# Altium project roach2_project rev2.PrjPCB (part 9 of 13)

## Sheet ppc_power.SchDoc: PowerPC Power Input
size A3; Date: DO NOT USE, RATHER USE PROJ OPTIONS; DrawnBy: DO NOT USE, RATHER USE PROJ OPTIONS; Engineer: DO NOT USE, RATHER USE PROJ OPTIONS; Organization: DO NOT USE, RATHER USE PROJ OPTIONS; DocumentNumber: DO NOT USE, RATHER USE PROJ OPTIONS; Revision: DO NOT USE, RATHER USE PROJ OPTIONS; SheetNumber: 4; SheetTotal: 27; SCH_Sheet_Filename: ppc_power.SchDoc; CurrentTime: DO NOT USE, RATHER USE PROJ OPTIONS; Time: DO NOT USE, RATHER USE PROJ OPTIONS; DocumentFullPathAndName: DO NOT USE, RATHER USE PROJ OPTIONS; DocumentName: DO NOT USE, RATHER USE PROJ OPTIONS; ModifiedDate: DO NOT USE, RATHER USE PROJ OPTIONS; ImagePath: DO NOT USE, RATHER USE PROJ OPTIONS
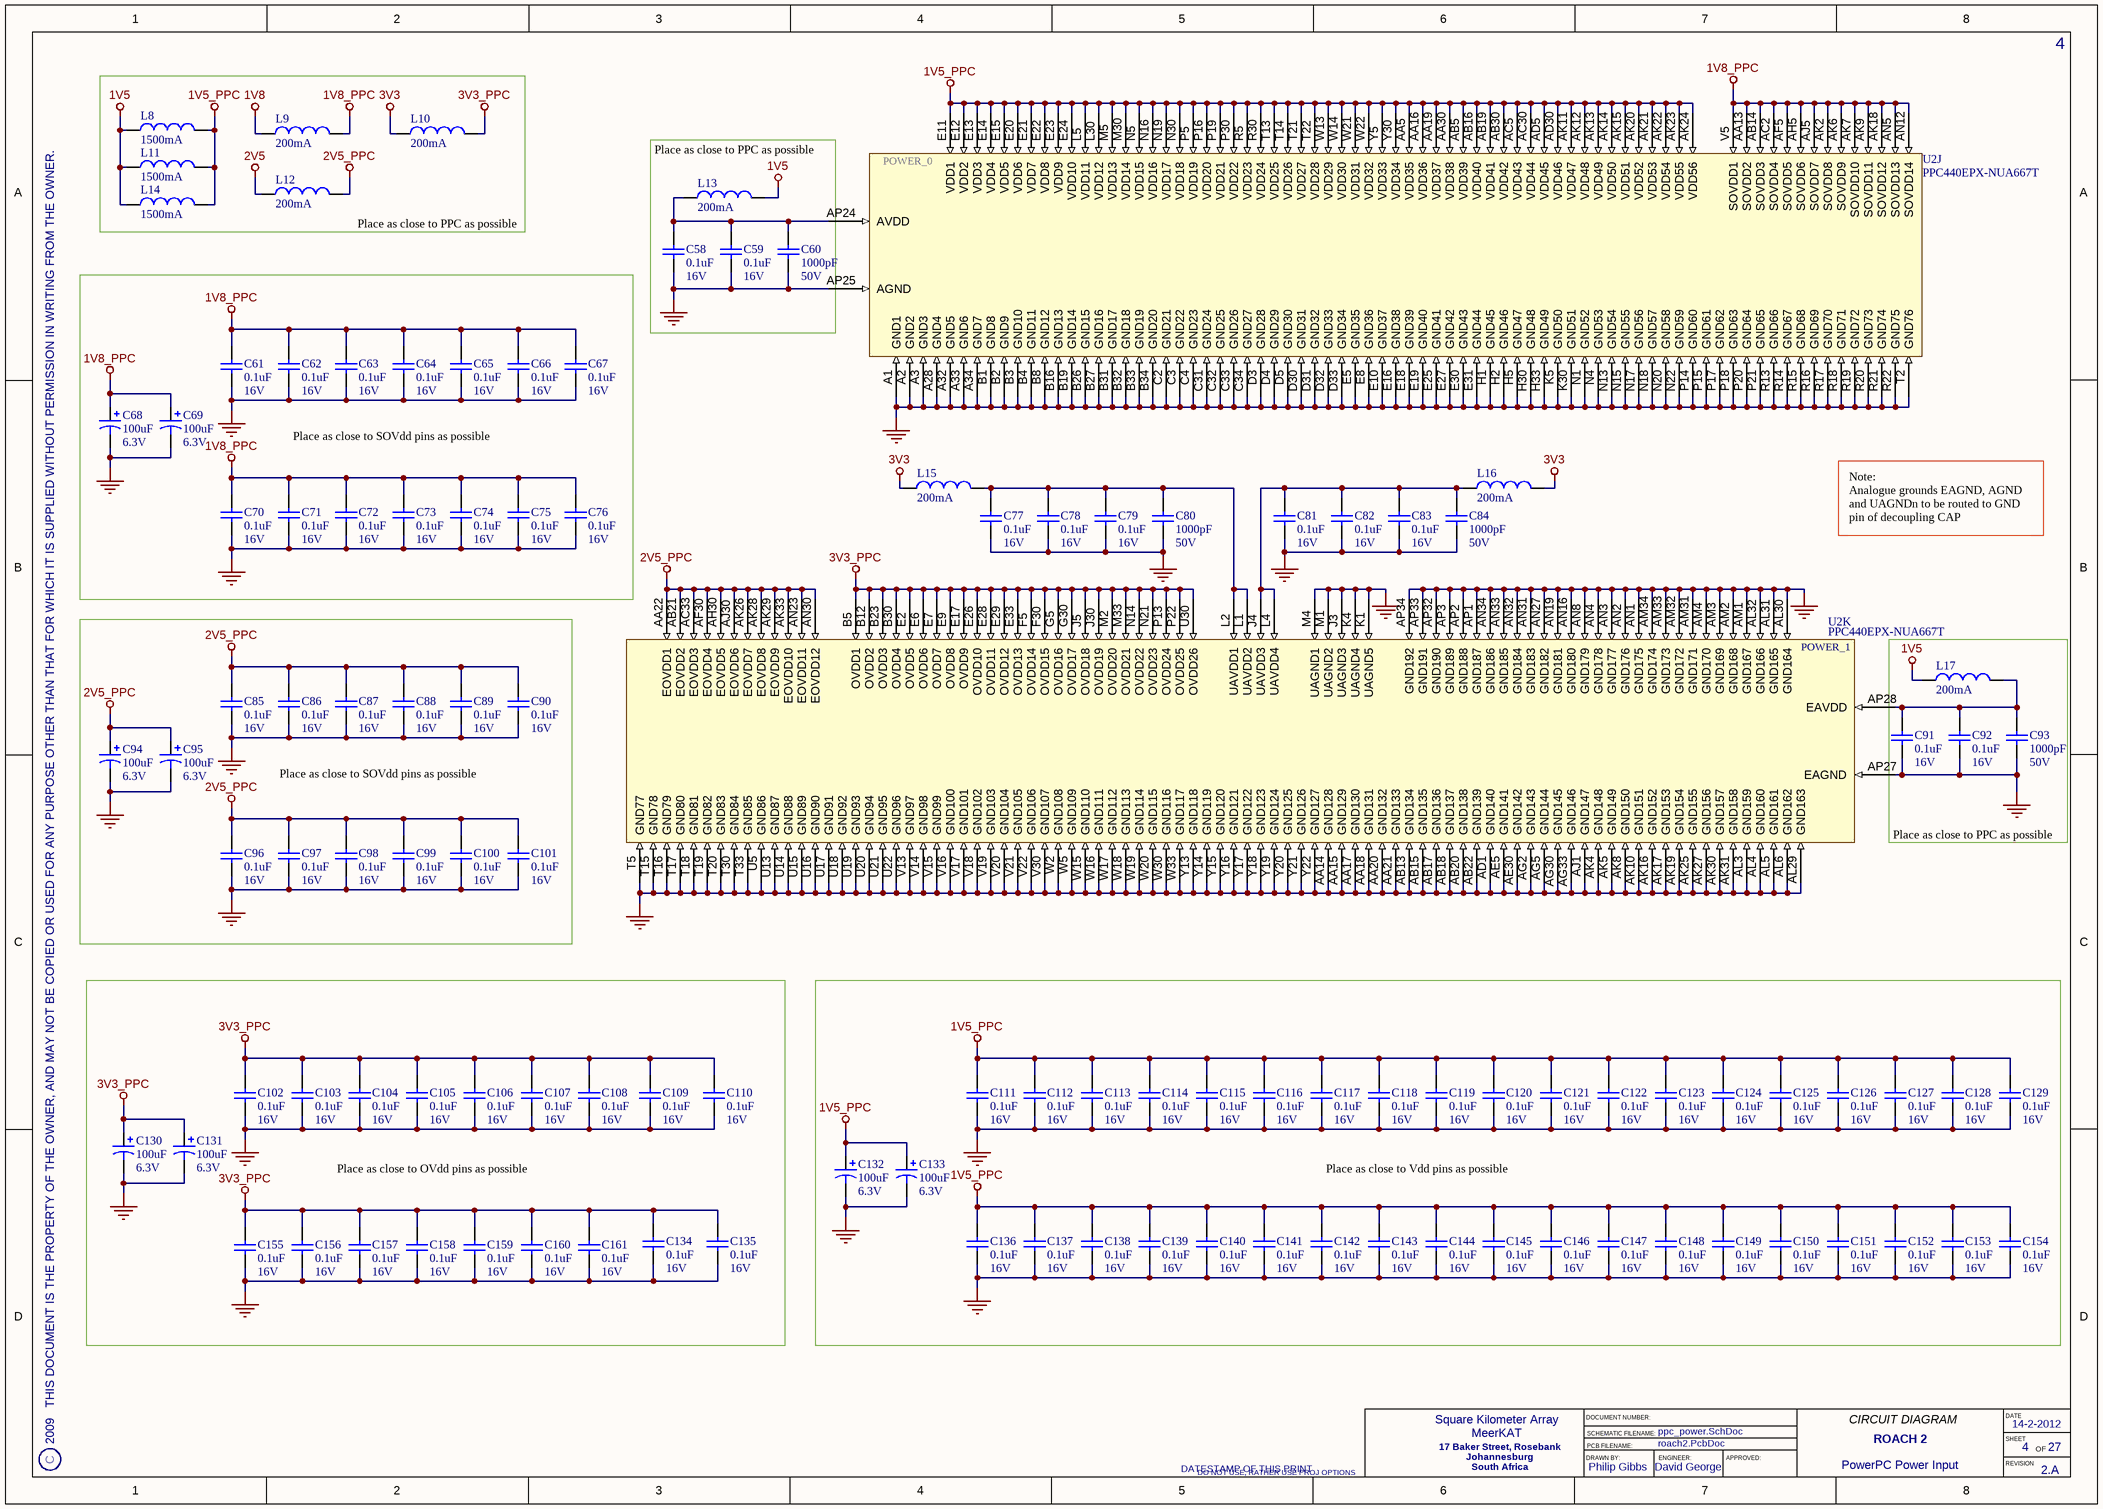
[diagram p19: ppc_power.SchDoc]

### Parts
C58  Rating: 16V  [CAPC1005X60L]  (hidden comment: 0.1uF)
C59  Rating: 16V  [CAPC1005X60L]  (hidden comment: 0.1uF)
C60  Rating: 50V  [CAPC1005X55L]  (hidden comment: 1000pF)
C61  Rating: 16V  [CAPC1005X60L]  (hidden comment: 0.1uF)
C62  Rating: 16V  [CAPC1005X60L]  (hidden comment: 0.1uF)
C63  Rating: 16V  [CAPC1005X60L]  (hidden comment: 0.1uF)
C64  Rating: 16V  [CAPC1005X60L]  (hidden comment: 0.1uF)
C65  Rating: 16V  [CAPC1005X60L]  (hidden comment: 0.1uF)
C66  Rating: 16V  [CAPC1005X60L]  (hidden comment: 0.1uF)
C67  Rating: 16V  [CAPC1005X60L]  (hidden comment: 0.1uF)
C68  Rating: 6.3V  [CAPMP3528X210L]  (hidden comment: 100uF)
C69  Rating: 6.3V  [CAPMP3528X210L]  (hidden comment: 100uF)
C70  Rating: 16V  [CAPC1005X60L]  (hidden comment: 0.1uF)
C71  Rating: 16V  [CAPC1005X60L]  (hidden comment: 0.1uF)
C72  Rating: 16V  [CAPC1005X60L]  (hidden comment: 0.1uF)
C73  Rating: 16V  [CAPC1005X60L]  (hidden comment: 0.1uF)
C74  Rating: 16V  [CAPC1005X60L]  (hidden comment: 0.1uF)
C75  Rating: 16V  [CAPC1005X60L]  (hidden comment: 0.1uF)
C76  Rating: 16V  [CAPC1005X60L]  (hidden comment: 0.1uF)
C77  Rating: 16V  [CAPC1005X60L]  (hidden comment: 0.1uF)
C78  Rating: 16V  [CAPC1005X60L]  (hidden comment: 0.1uF)
C79  Rating: 16V  [CAPC1005X60L]  (hidden comment: 0.1uF)
C80  Rating: 50V  [CAPC1005X55L]  (hidden comment: 1000pF)
C81  Rating: 16V  [CAPC1005X60L]  (hidden comment: 0.1uF)
C82  Rating: 16V  [CAPC1005X60L]  (hidden comment: 0.1uF)
C83  Rating: 16V  [CAPC1005X60L]  (hidden comment: 0.1uF)
C84  Rating: 50V  [CAPC1005X55L]  (hidden comment: 1000pF)
C85  Rating: 16V  [CAPC1005X60L]  (hidden comment: 0.1uF)
C86  Rating: 16V  [CAPC1005X60L]  (hidden comment: 0.1uF)
C87  Rating: 16V  [CAPC1005X60L]  (hidden comment: 0.1uF)
C88  Rating: 16V  [CAPC1005X60L]  (hidden comment: 0.1uF)
C89  Rating: 16V  [CAPC1005X60L]  (hidden comment: 0.1uF)
C90  Rating: 16V  [CAPC1005X60L]  (hidden comment: 0.1uF)
C91  Rating: 16V  [CAPC1005X60L]  (hidden comment: 0.1uF)
C92  Rating: 16V  [CAPC1005X60L]  (hidden comment: 0.1uF)
C93  Rating: 50V  [CAPC1005X55L]  (hidden comment: 1000pF)
C94  Rating: 6.3V  [CAPMP3528X210L]  (hidden comment: 100uF)
C95  Rating: 6.3V  [CAPMP3528X210L]  (hidden comment: 100uF)
C96  Rating: 16V  [CAPC1005X60L]  (hidden comment: 0.1uF)
C97  Rating: 16V  [CAPC1005X60L]  (hidden comment: 0.1uF)
C98  Rating: 16V  [CAPC1005X60L]  (hidden comment: 0.1uF)
C99  Rating: 16V  [CAPC1005X60L]  (hidden comment: 0.1uF)
C100  Rating: 16V  [CAPC1005X60L]  (hidden comment: 0.1uF)
C101  Rating: 16V  [CAPC1005X60L]  (hidden comment: 0.1uF)
C102  Rating: 16V  [CAPC1005X60L]  (hidden comment: 0.1uF)
C103  Rating: 16V  [CAPC1005X60L]  (hidden comment: 0.1uF)
C104  Rating: 16V  [CAPC1005X60L]  (hidden comment: 0.1uF)
C105  Rating: 16V  [CAPC1005X60L]  (hidden comment: 0.1uF)
C106  Rating: 16V  [CAPC1005X60L]  (hidden comment: 0.1uF)
C107  Rating: 16V  [CAPC1005X60L]  (hidden comment: 0.1uF)
C108  Rating: 16V  [CAPC1005X60L]  (hidden comment: 0.1uF)
C109  Rating: 16V  [CAPC1005X60L]  (hidden comment: 0.1uF)
C110  Rating: 16V  [CAPC1005X60L]  (hidden comment: 0.1uF)
C111  Rating: 16V  [CAPC1005X60L]  (hidden comment: 0.1uF)
C112  Rating: 16V  [CAPC1005X60L]  (hidden comment: 0.1uF)
C113  Rating: 16V  [CAPC1005X60L]  (hidden comment: 0.1uF)
C114  Rating: 16V  [CAPC1005X60L]  (hidden comment: 0.1uF)
C115  Rating: 16V  [CAPC1005X60L]  (hidden comment: 0.1uF)
C116  Rating: 16V  [CAPC1005X60L]  (hidden comment: 0.1uF)
C117  Rating: 16V  [CAPC1005X60L]  (hidden comment: 0.1uF)
C118  Rating: 16V  [CAPC1005X60L]  (hidden comment: 0.1uF)
C119  Rating: 16V  [CAPC1005X60L]  (hidden comment: 0.1uF)
C120  Rating: 16V  [CAPC1005X60L]  (hidden comment: 0.1uF)
C121  Rating: 16V  [CAPC1005X60L]  (hidden comment: 0.1uF)
C122  Rating: 16V  [CAPC1005X60L]  (hidden comment: 0.1uF)
C123  Rating: 16V  [CAPC1005X60L]  (hidden comment: 0.1uF)
C124  Rating: 16V  [CAPC1005X60L]  (hidden comment: 0.1uF)
C125  Rating: 16V  [CAPC1005X60L]  (hidden comment: 0.1uF)
C126  Rating: 16V  [CAPC1005X60L]  (hidden comment: 0.1uF)
C127  Rating: 16V  [CAPC1005X60L]  (hidden comment: 0.1uF)
C128  Rating: 16V  [CAPC1005X60L]  (hidden comment: 0.1uF)
C129  Rating: 16V  [CAPC1005X60L]  (hidden comment: 0.1uF)
C130  Rating: 6.3V  [CAPMP3528X210L]  (hidden comment: 100uF)
C131  Rating: 6.3V  [CAPMP3528X210L]  (hidden comment: 100uF)
C132  Rating: 6.3V  [CAPMP3528X210L]  (hidden comment: 100uF)
C133  Rating: 6.3V  [CAPMP3528X210L]  (hidden comment: 100uF)
C134  Rating: 16V  [CAPC1005X60L]  (hidden comment: 0.1uF)
C135  Rating: 16V  [CAPC1005X60L]  (hidden comment: 0.1uF)
C136  Rating: 16V  [CAPC1005X60L]  (hidden comment: 0.1uF)
C137  Rating: 16V  [CAPC1005X60L]  (hidden comment: 0.1uF)
C138  Rating: 16V  [CAPC1005X60L]  (hidden comment: 0.1uF)
C139  Rating: 16V  [CAPC1005X60L]  (hidden comment: 0.1uF)
C140  Rating: 16V  [CAPC1005X60L]  (hidden comment: 0.1uF)
C141  Rating: 16V  [CAPC1005X60L]  (hidden comment: 0.1uF)
C142  Rating: 16V  [CAPC1005X60L]  (hidden comment: 0.1uF)
C143  Rating: 16V  [CAPC1005X60L]  (hidden comment: 0.1uF)
C144  Rating: 16V  [CAPC1005X60L]  (hidden comment: 0.1uF)
C145  Rating: 16V  [CAPC1005X60L]  (hidden comment: 0.1uF)
C146  Rating: 16V  [CAPC1005X60L]  (hidden comment: 0.1uF)
C147  Rating: 16V  [CAPC1005X60L]  (hidden comment: 0.1uF)
C148  Rating: 16V  [CAPC1005X60L]  (hidden comment: 0.1uF)
C149  Rating: 16V  [CAPC1005X60L]  (hidden comment: 0.1uF)
C150  Rating: 16V  [CAPC1005X60L]  (hidden comment: 0.1uF)
C151  Rating: 16V  [CAPC1005X60L]  (hidden comment: 0.1uF)
C152  Rating: 16V  [CAPC1005X60L]  (hidden comment: 0.1uF)
C153  Rating: 16V  [CAPC1005X60L]  (hidden comment: 0.1uF)
C154  Rating: 16V  [CAPC1005X60L]  (hidden comment: 0.1uF)
C155  Rating: 16V  [CAPC1005X60L]  (hidden comment: 0.1uF)
C156  Rating: 16V  [CAPC1005X60L]  (hidden comment: 0.1uF)
C157  Rating: 16V  [CAPC1005X60L]  (hidden comment: 0.1uF)
C158  Rating: 16V  [CAPC1005X60L]  (hidden comment: 0.1uF)
C159  Rating: 16V  [CAPC1005X60L]  (hidden comment: 0.1uF)
C160  Rating: 16V  [CAPC1005X60L]  (hidden comment: 0.1uF)
C161  Rating: 16V  [CAPC1005X60L]  (hidden comment: 0.1uF)
L8  Rating: 1500mA  [INDC1608X130L]  (hidden comment: 180R)
L9  Rating: 200mA  [INDC2012X130L]  (hidden comment: 600R)
L10  Rating: 200mA  [INDC2012X130L]  (hidden comment: 600R)
L11  Rating: 1500mA  [INDC1608X130L]  (hidden comment: 180R)
L12  Rating: 200mA  [INDC2012X130L]  (hidden comment: 600R)
L13  Rating: 200mA  [INDC2012X130L]  (hidden comment: 600R)
L14  Rating: 1500mA  [INDC1608X130L]  (hidden comment: 180R)
L15  Rating: 200mA  [INDC2012X130L]  (hidden comment: 600R)
L16  Rating: 200mA  [INDC2012X130L]  (hidden comment: 600R)
L17  Rating: 200mA  [INDC2012X130L]  (hidden comment: 600R)
U2  PPC440EPX-NUA667T  [TE-PBGA680]  (parts J,K of 11)

### Nets
1V5: L8.1 L11.1 L13.2 L14.1 L17.1
1V5_PPC: C111.2 C112.2 C113.2 C114.2 C115.2 C116.2 C117.2 C118.2 C119.2 C120.2 C121.2 C122.2 C123.2 C124.2 C125.2 C126.2 C127.2 C128.2 C129.2 C132.1 C133.1 C136.2 C137.2 C138.2 C139.2 C140.2 C141.2 C142.2 C143.2 C144.2 C145.2 C146.2 C147.2 C148.2 C149.2 C150.2 C151.2 C152.2 C153.2 C154.2 L8.2 L11.2 L14.2 U2.AA5(VDD35) U2.AA16(VDD36) U2.AA19(VDD37) U2.AA30(VDD38) U2.AB5(VDD39) U2.AB16(VDD40) U2.AB19(VDD41) U2.AB30(VDD42) U2.AC5(VDD43) U2.AC30(VDD44) U2.AD5(VDD45) U2.AD30(VDD46) U2.AK11(VDD47) U2.AK12(VDD48) U2.AK13(VDD49) U2.AK14(VDD50) U2.AK15(VDD51) U2.AK20(VDD52) U2.AK21(VDD53) U2.AK22(VDD54) U2.AK23(VDD55) U2.AK24(VDD56) U2.E11(VDD1) U2.E12(VDD2) U2.E13(VDD3) U2.E14(VDD4) U2.E15(VDD5) U2.E20(VDD6) U2.E21(VDD7) U2.E22(VDD8) U2.E23(VDD9) U2.E24(VDD10) U2.L5(VDD11) U2.L30(VDD12) U2.M5(VDD13) U2.M30(VDD14) U2.N5(VDD15) U2.N16(VDD16) U2.N19(VDD17) U2.N30(VDD18) U2.P5(VDD19) U2.P16(VDD20) U2.P19(VDD21) U2.P30(VDD22) U2.R5(VDD23) U2.R30(VDD24) U2.T13(VDD25) U2.T14(VDD26) U2.T21(VDD27) U2.T22(VDD28) U2.W13(VDD29) U2.W14(VDD30) U2.W21(VDD31) U2.W22(VDD32) U2.Y5(VDD33) U2.Y30(VDD34)
1V8: L9.1
1V8_PPC: C61.2 C62.2 C63.2 C64.2 C65.2 C66.2 C67.2 C68.1 C69.1 C70.2 C71.2 C72.2 C73.2 C74.2 C75.2 C76.2 L9.2 U2.AA13(SOVDD2) U2.AB14(SOVDD3) U2.AC2(SOVDD4) U2.AF5(SOVDD5) U2.AH5(SOVDD6) U2.AJ5(SOVDD7) U2.AK2(SOVDD8) U2.AK6(SOVDD9) U2.AK7(SOVDD10) U2.AK9(SOVDD11) U2.AK18(SOVDD12) U2.AN5(SOVDD13) U2.AN12(SOVDD14) U2.V5(SOVDD1)
2V5: L12.1
2V5_PPC: C85.2 C86.2 C87.2 C88.2 C89.2 C90.2 C94.1 C95.1 C96.2 C97.2 C98.2 C99.2 C100.2 C101.2 L12.2 U2.AA22(EOVDD1) U2.AB21(EOVDD2) U2.AC33(EOVDD3) U2.AF30(EOVDD4) U2.AH30(EOVDD5) U2.AJ30(EOVDD6) U2.AK26(EOVDD7) U2.AK28(EOVDD8) U2.AK29(EOVDD9) U2.AK33(EOVDD10) U2.AN23(EOVDD11) U2.AN30(EOVDD12)
3V3: L10.1 L15.1 L16.2
3V3_PPC: C102.2 C103.2 C104.2 C105.2 C106.2 C107.2 C108.2 C109.2 C110.2 C130.1 C131.1 C134.2 C135.2 C155.2 C156.2 C157.2 C158.2 C159.2 C160.2 C161.2 L10.2 U2.B5(OVDD1) U2.B12(OVDD2) U2.B23(OVDD3) U2.B30(OVDD4) U2.E2(OVDD5) U2.E6(OVDD6) U2.E7(OVDD7) U2.E9(OVDD8) U2.E17(OVDD9) U2.E26(OVDD10) U2.E28(OVDD11) U2.E29(OVDD12) U2.E33(OVDD13) U2.F5(OVDD14) U2.F30(OVDD15) U2.G5(OVDD16) U2.G30(OVDD17) U2.J5(OVDD18) U2.J30(OVDD19) U2.M2(OVDD20) U2.M33(OVDD21) U2.N14(OVDD22) U2.N21(OVDD23) U2.P13(OVDD24) U2.P22(OVDD25) U2.U30(OVDD26)
GND: C58.1 C59.1 C60.1 C61.1 C62.1 C63.1 C64.1 C65.1 C66.1 C67.1 C68.2 C69.2 C70.1 C71.1 C72.1 C73.1 C74.1 C75.1 C76.1 C77.1 C78.1 C79.1 C80.1 C81.1 C82.1 C83.1 C84.1 C85.1 C86.1 C87.1 C88.1 C89.1 C90.1 C91.1 C92.1 C93.1 C94.2 C95.2 C96.1 C97.1 C98.1 C99.1 C100.1 C101.1 C102.1 C103.1 C104.1 C105.1 C106.1 C107.1 C108.1 C109.1 C110.1 C111.1 C112.1 C113.1 C114.1 C115.1 C116.1 C117.1 C118.1 C119.1 C120.1 C121.1 C122.1 C123.1 C124.1 C125.1 C126.1 C127.1 C128.1 C129.1 C130.2 C131.2 C132.2 C133.2 C134.1 C135.1 C136.1 C137.1 C138.1 C139.1 C140.1 C141.1 C142.1 C143.1 C144.1 C145.1 C146.1 C147.1 C148.1 C149.1 C150.1 C151.1 C152.1 C153.1 C154.1 C155.1 C156.1 C157.1 C158.1 C159.1 C160.1 C161.1 U2.A1(GND1) U2.A2(GND2) U2.A3(GND3) U2.A28(GND4) U2.A32(GND5) U2.A33(GND6) U2.A34(GND7) U2.AA14(GND128) U2.AA15(GND129) U2.AA17(GND130) U2.AA18(GND131) U2.AA20(GND132) U2.AA21(GND133) U2.AB13(GND134) U2.AB15(GND135) U2.AB17(GND136) U2.AB18(GND137) U2.AB20(GND138) U2.AB22(GND139) U2.AD1(GND140) U2.AE5(GND141) U2.AE30(GND142) U2.AG2(GND143) U2.AG5(GND144) U2.AG30(GND145) U2.AG33(GND146) U2.AJ1(GND147) U2.AK4(GND148) U2.AK5(GND149) U2.AK8(GND150) U2.AK10(GND151) U2.AK16(GND152) U2.AK17(GND153) U2.AK19(GND154) U2.AK25(GND155) U2.AK27(GND156) U2.AK30(GND157) U2.AK31(GND158) U2.AL3(GND159) U2.AL4(GND160) U2.AL5(GND161) U2.AL6(GND162) U2.AL29(GND163) U2.AL30(GND164) U2.AL31(GND165) U2.AL32(GND166) U2.AM1(GND167) U2.AM2(GND168) U2.AM3(GND169) U2.AM4(GND170) U2.AM31(GND171) U2.AM32(GND172) U2.AM33(GND173) U2.AM34(GND174) U2.AN1(GND175) U2.AN2(GND176) U2.AN3(GND177) U2.AN4(GND178) U2.AN8(GND179) U2.AN16(GND180) U2.AN19(GND181) U2.AN27(GND182) U2.AN31(GND183) U2.AN32(GND184) U2.AN33(GND185) U2.AN34(GND186) U2.AP1(GND187) U2.AP2(GND188) U2.AP3(GND189) U2.AP25(AGND) U2.AP27(EAGND) U2.AP32(GND190) U2.AP33(GND191) U2.AP34(GND192) U2.B1(GND8) U2.B2(GND9) U2.B3(GND10) U2.B4(GND11) U2.B8(GND12) U2.B16(GND13) U2.B19(GND14) U2.B26(GND15) U2.B27(GND16) U2.B31(GND17) U2.B32(GND18) U2.B33(GND19) U2.B34(GND20) U2.C2(GND21) U2.C3(GND22) U2.C4(GND23) U2.C31(GND24) U2.C32(GND25) U2.C33(GND26) U2.C34(GND27) U2.D3(GND28) U2.D4(GND29) U2.D5(GND30) U2.D30(GND31) U2.D31(GND32) U2.D32(GND33) U2.D33(GND34) U2.E5(GND35) U2.E8(GND36) U2.E10(GND37) U2.E16(GND38) U2.E18(GND39) U2.E19(GND40) U2.E25(GND41) U2.E27(GND42) U2.E30(GND43) U2.E31(GND44) U2.H1(GND45) U2.H2(GND46) U2.H5(GND47) U2.H30(GND48) U2.H33(GND49) U2.J3(UAGND3) U2.K1(UAGND5) U2.K4(UAGND4) U2.K5(GND50) U2.K30(GND51) U2.M1(UAGND2) U2.M4(UAGND1) U2.N1(GND52) U2.N4(GND53) U2.N13(GND54) U2.N15(GND55) U2.N17(GND56) U2.N18(GND57) U2.N20(GND58) U2.N22(GND59) U2.P14(GND60) U2.P15(GND61) U2.P17(GND62) U2.P18(GND63) U2.P20(GND64) U2.P21(GND65) U2.R13(GND66) U2.R14(GND67) U2.R15(GND68) U2.R16(GND69) U2.R17(GND70) U2.R18(GND71) U2.R19(GND72) U2.R20(GND73) U2.R21(GND74) U2.R22(GND75) U2.T2(GND76) U2.T5(GND77) U2.T15(GND78) U2.T16(GND79) U2.T17(GND80) U2.T18(GND81) U2.T19(GND82) U2.T20(GND83) U2.T30(GND84) U2.T33(GND85) U2.U5(GND86) U2.U13(GND87) U2.U14(GND88) U2.U15(GND89) U2.U16(GND90) U2.U17(GND91) U2.U18(GND92) U2.U19(GND93) U2.U20(GND94) U2.U21(GND95) U2.U22(GND96) U2.V13(GND97) U2.V14(GND98) U2.V15(GND99) U2.V16(GND100) U2.V17(GND101) U2.V18(GND102) U2.V19(GND103) U2.V20(GND104) U2.V21(GND105) U2.V22(GND106) U2.V30(GND107) U2.W2(GND108) U2.W5(GND109) U2.W15(GND110) U2.W16(GND111) U2.W17(GND112) U2.W18(GND113) U2.W19(GND114) U2.W20(GND115) U2.W30(GND116) U2.W33(GND117) U2.Y13(GND118) U2.Y14(GND119) U2.Y15(GND120) U2.Y16(GND121) U2.Y17(GND122) U2.Y18(GND123) U2.Y19(GND124) U2.Y20(GND125) U2.Y21(GND126) U2.Y22(GND127)
NetC58_2: C58.2 C59.2 C60.2 L13.1 U2.AP24(AVDD)
NetC77_2: C77.2 C78.2 C79.2 C80.2 L15.2 U2.L1(UAVDD2) U2.L2(UAVDD1)
NetC81_2: C81.2 C82.2 C83.2 C84.2 L16.1 U2.J4(UAVDD3) U2.L4(UAVDD4)
NetC91_2: C91.2 C92.2 C93.2 L17.2 U2.AP28(EAVDD)

### Notes on the sheet
- (near L12) Place as close to PPC as possible
- (near L13) Place as close to PPC as possible
- Place as close to SOVdd pins as possible
- Note:
  Analogue grounds EAGND, AGND and UAGNDn to be routed to GND pin of decoupling CAP
- (near U2) Place as close to PPC as possible
- Place as close to OVdd pins as possible
- Place as close to Vdd pins as possible
- 2009   THIS DOCUMENT IS THE PROPERTY OF THE OWNER, AND MAY NOT BE COPIED OR USED FOR ANY PURPOSE OTHER THAN THAT FOR WHICH IT IS SUPPLIED WITHOUT PERMISSION IN WRITING FROM THE OWNER.
- C
- DATESTAMP OF THIS PRINT
- DRAWN BY:
- DOCUMENT NUMBER:
- SCHEMATIC FILENAME:
- PCB FILENAME:
- ENGINEER:
- APPROVED:
- CIRCUIT DIAGRAM
- DATE
- SHEET
- REVISION
- OF
- (in symbol IC-CPU-1, part J) POWER_0
- (in symbol IC-CPU-1, part K) POWER_1

### Library data of the parts
C58 C59 C61-C67 C70-C79 C81-C83 C85-C92 C96-C129 C134-C161 = CAP-CER-1: 0.1uF, Ceramic Capacitor; Manufacturer: VENKEL; PartNum: C0402X7R160-104KN; Tolerance: 10%; Dielectric: X7R; POD number: CAP-CER-1; Value: 0.1uF; RoHS: Y; Sort Value: 0.1; Category: Capacitors; Subcategory: Ceramic
C60 C80 C84 C93 = CAP-CER-4: 1000pF, Ceramic Capacitor; Manufacturer: MURATA; PartNum: GRM155R61H102KA01D; Tolerance: 10%; Dielectric: X5R; POD number: CAP-CER-4; Value: 1000pF; RoHS: Y; Sort Value: 0.0001; Category: Capacitors; Subcategory: Ceramic
C68 C69 C94 C95 C130-C133 = CAP-TAN-6: as C673-C678 on sheet zdoks; POD number: CAP-TAN-6; Value: 100uF; RoHS: Y; Sort Value: 100; Category: Capacitors; Subcategory: Tantalum
L8 L11 L14 = IND-FB-2: 180 Ohm, Chip Ferrite Brad; Manufacturer: Murata; PartNum: BLM18PG181SN1; DC Res: 0.09R; Tolerance: 25%; POD number: IND-FB-2; RoHS: Y; Value: 180R; Sort Value: 180; Category: Inductors; Subcategory: FerriteBead
L9 L10 L12 L13 L15-L17 = IND-FB-0: 600 Ohm, Chip Ferrite Bead; Manufacturer: Murata; PartNum: BLM21BD601SN1; DC Res: 0.35R; Tolerance: 25%; POD number: IND-FB-0; RoHS: Y; Value: 600R; Sort Value: 600; Category: Inductors; Subcategory: FerriteBead
U2 = IC-CPU-1: 667MHz, non-RoHS, PPC440EPx uProcessor; Manufacturer: Applied Micro; POD number: IC-CPU-1; PartNum: PPC440EPX-NUA667T; RoHS: Y; Category: IC; Subcategory: CPU